# Altium schematic sheet FU-AM-FU6861-B-025-HW-V1.0-20210601.SCHDOC: ?
size A3; SheetNumber: 0; SheetTotal: 0; PageSetup: Record=PageOptions|CenterHorizontal=True|CenterVertical=True|PrintScale=0.81|XCorrection=1.00|YCorrection=1.00|PrintKind=0|BorderSize=5000000|LeftOffset=0|BottomOffset=0|Orientation=2|PaperLength=1000|PaperWidth=1000|Scale=100|PaperSource=7|PrintQuality=-4|MediaType=1|DitherType=10|PaperKind=A4|PrintScaleMode=1
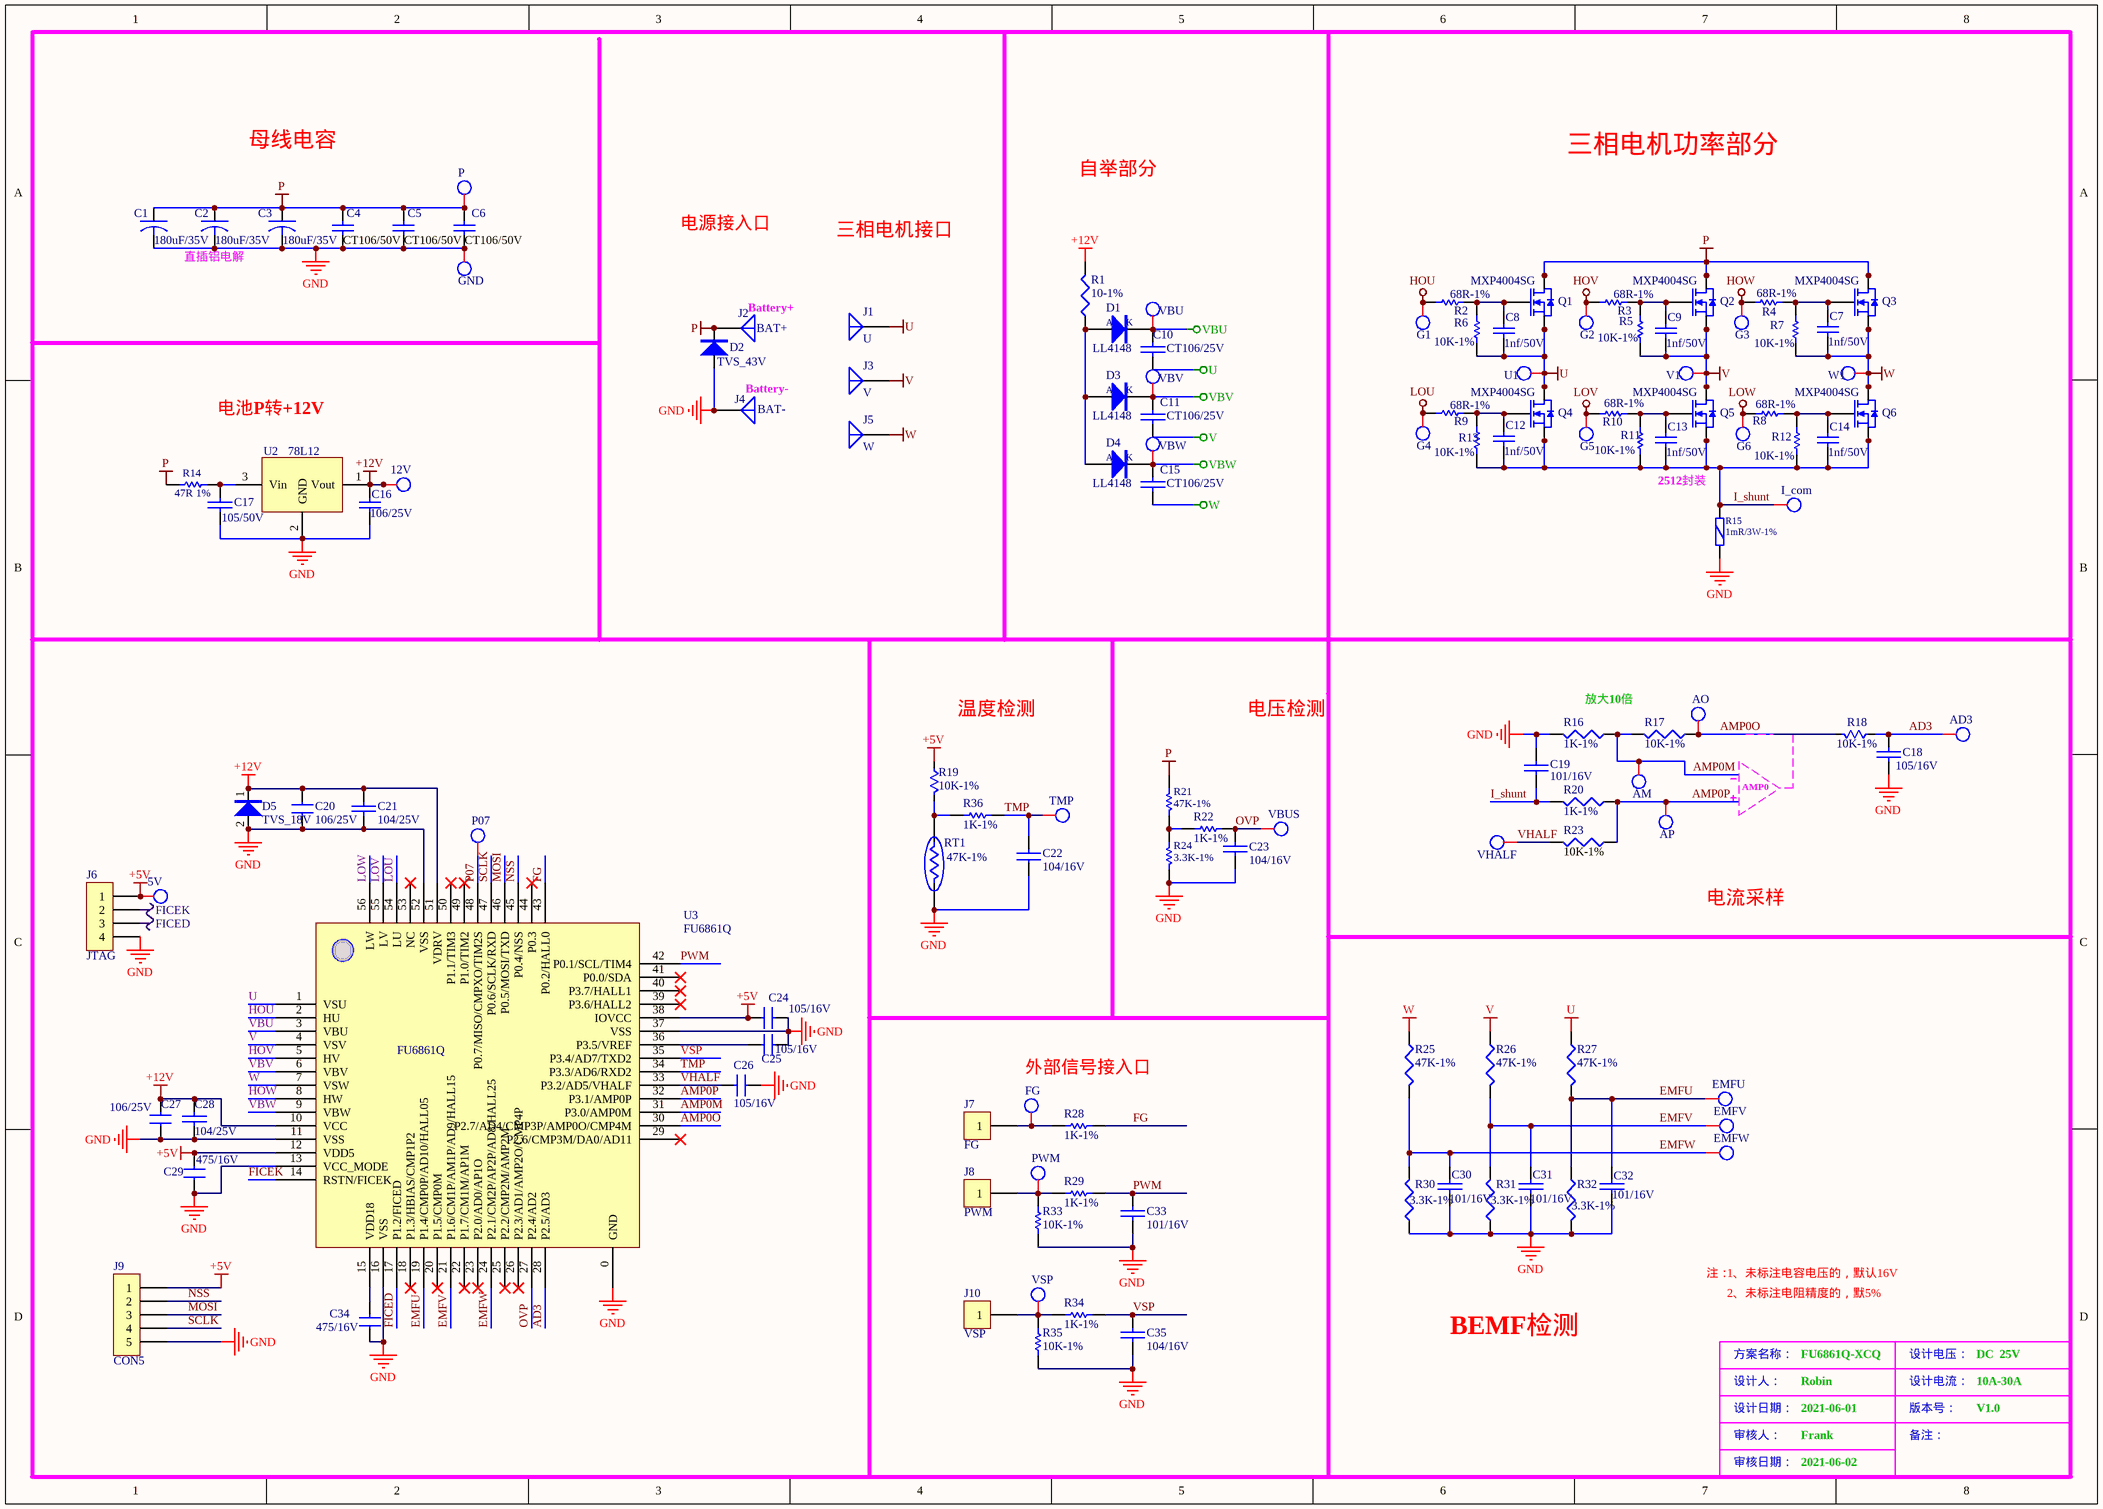
[diagram p0: FU-AM-FU6861-B-025-HW-V1.0-20210601.SCHDOC]

## Parts
5V  (no value)  [TP1.1]
12V  (no value)  [TP1.1]
AD3  (no value)  [TP1.1]
AM  (no value)  [TP1.1]
AO  (no value)  [TP1.1]
AP  (no value)  [TP1.1]
C1  180uF/35V  [CAP2_5]
C2  180uF/35V  [CAP2_5]
C3  180uF/35V  [CAP2_5]
C4  CT106/50V  [c1206]
C5  CT106/50V  [c1206]
C6  CT106/50V  [c1206]
C7  1nf/50V  [c0603]
C8  1nf/50V  [C0603]
C9  1nf/50V  [C0603]
C10  CT106/25V  [c0805]
C11  CT106/25V  [c0805]
C12  1nf/50V  [c0603]
C13  1nf/50V  [C0603]
C14  1nf/50V  [C0603]
C15  CT106/25V  [c0805]
C16  106/25V  [C0805]
C17  105/50V  [c1206]
C18  105/16V  [c0603]
C19  101/16V  [c0603]
C20  106/25V  [c0805]
C21  104/25V  [c0603]
C22  104/16V  [c0603]
C23  104/16V  [c0603]
C24  105/16V  [c0603]
C25  105/16V  [c0603]
C26  105/16V  [c0603]
C27  106/25V  [c0805]
C28  104/25V  [c0603]
C29  475/16V  [c0603]
C30  101/16V  [c0603]
C31  101/16V  [c0603]
C32  101/16V  [c0603]
C33  101/16V  [c0603]
C34  475/16V  [c0603]
C35  104/16V  [c0603]
D1  LL4148  [SOD-123]
D2  TVS_43V  [DO214AA, SMB]
D3  LL4148  [SOD-123]
D4  LL4148  [SOD-123]
D5  TVS_18V  [DO214AC, SMA]
EMFU  (no value)  [TP1.1]
EMFV  (no value)  [TP1.1]
EMFW  (no value)  [TP1.1]
FG  (no value)  [TP1.1]
G1  (no value)  [TP1.1]
G2  (no value)  [TP1.1]
G3  (no value)  [TP1.1]
G4  (no value)  [TP1.1]
G5  (no value)  [TP1.1]
G6  (no value)  [TP1.1]
GND  (no value)  [TP1.1]
I_com  (no value)  [TP1.1]
J1  U  [AD]
J2  BAT+  [DY]
J3  V  [AD]
J4  BAT-  [DY]
J5  W  [AD]
J6  JTAG  [SIP4-2]
J7  FG  [tp]
J8  PWM  [tp]
J9  CON5  [SIP5-2]
J10  VSP  [tp]
P  (no value)  [TP1.1]
P07  (no value)  [TP1.1]
PWM  (no value)  [TP1.1]
Q1  MXP4004SG  [PQFQ5X6]
Q2  MXP4004SG  [PQFQ5X6]
Q3  MXP4004SG  [PQFQ5X6]
Q4  MXP4004SG  [PQFQ5X6]
Q5  MXP4004SG  [PQFQ5X6]
Q6  MXP4004SG  [PQFQ5X6]
R1  10-1%  [r1206]
R2  68R-1%  [r0603]
R3  68R-1%  [r0603]
R4  68R-1%  [r0603]
R5  10K-1%  [r0603]
R6  10K-1%  [r0603]
R7  10K-1%  [r0603]
R8  68R-1%  [r0603]
R9  68R-1%  [r0603]
R10  68R-1%  [r0603]
R11  10K-1%  [r0603]
R12  10K-1%  [r0603]
R13  10K-1%  [r0603]
R14  47R 1%  [R1206]
R15  1mR/3W-1%  [r2512]
R16  1K-1%  [r0603]
R17  10K-1%  [r0603]
R18  10K-1%  [r0603]
R19  10K-1%  [r0603]
R20  1K-1%  [r0603]
R21  47K-1%  [r0603]
R22  1K-1%  [r0603]
R23  10K-1%  [r0603]
R24  3.3K-1%  [r0603]
R25  47K-1%  [r0603]
R26  47K-1%  [r0603]
R27  47K-1%  [r0603]
R28  1K-1%  [r0603]
R29  1K-1%  [r0603]
R30  3.3K-1%  [r0603]
R31  3.3K-1%  [r0603]
R32  3.3K-1%  [r0603]
R33  10K-1%  [r0603]
R34  1K-1%  [r0603]
R35  10K-1%  [r0603]
R36  1K-1%  [r0603]
RT1  47K-1%  [r0805]
TMP  (no value)  [TP1.1]
U1  (no value)  [TP1.1]
U2  78L12  [SOT-89]
U3  FU6861Q  [QFN56]
V1  (no value)  [TP1.1]
VBU  (no value)  [TP1.1]
VBUS  (no value)  [TP1.1]
VBV  (no value)  [TP1.1]
VBW  (no value)  [TP1.1]
VHALF  (no value)  [TP1.1]
VSP  (no value)  [TP1.1]
W1  (no value)  [TP1.1]

## Nets
+5V: 5V.1 C24.1 C29.1 J6.1 J9.1 R19.1 U3.12(VDD5) U3.38(IOVCC)
+12V: 12V.1 C16.2 C20.2 C21.2 C27.2 C28.1 D5.1 R1.2 U2.1(Vout) U3.10(VCC) U3.51(VDRV)
FICED: J6.3 U3.17(P1.2/FICED)
FICEK: J6.2 U3.14(RSTN/FICEK)
GND: C1.2 C2.2 C3.2 C4.1 C5.1 C6.1 C16.1 C17.2 C18.2 C19.1 C20.1 C21.1 C22.1 C23.2 C24.2 C25.1 C26.2 C27.1 C28.2 C29.2 C30.2 C31.2 C32.1 C33.1 C34.2 C35.1 D2.2 D5.2 GND.1 J4.1(GND) J6.4 J9.5 R15.1 R16.2 R24.2 R30.1 R31.1 R32.2 R33.1 R35.1 RT1.2 U2.2(GND) U3.0(GND) U3.11(VSS) U3.13(VCC_MODE) U3.16(VSS) U3.37(VSS) U3.52(VSS)
HOU: G1.1 R2.1 U3.2(HU)
HOV: G2.1 R3.1 U3.5(HV)
HOW: G3.1 R4.1 U3.8(HW)
LOU: G4.1 R9.1 U3.54(LU)
LOV: G5.1 R10.1 U3.55(LV)
LOW: G6.1 R8.1 U3.56(LW)
P: C1.1 C2.1 C3.1 C4.2 C5.2 C6.2 D2.1 J2.1(+42V) P.1 Q1.5(D) Q1.6(D) Q1.7(D) Q1.8(D) Q2.5(D) Q2.6(D) Q2.7(D) Q2.8(D) Q3.5(D) Q3.6(D) Q3.7(D) Q3.8(D) R14.1 R21.1
U: C8.1 C10.1 J1.1(U) Q1.1(S) Q1.2(S) Q1.3(S) Q4.5(D) Q4.6(D) Q4.7(D) Q4.8(D) R6.1 R27.1 U1.1 U3.1(VSU)
V: C9.1 C11.1 J3.1(V) Q2.1(S) Q2.2(S) Q2.3(S) Q5.5(D) Q5.6(D) Q5.7(D) Q5.8(D) R5.1 R26.1 U3.4(VSV) V1.1
VBU: C10.2 D1.2 U3.3(VBU) VBU.1
VBV: C11.2 D3.2 U3.6(VBV) VBV.1
VBW: C15.2 D4.2 U3.9(VBW) VBW.1
W: C7.1 C15.1 J5.1(W) Q3.1(S) Q3.2(S) Q3.3(S) Q6.5(D) Q6.6(D) Q6.7(D) Q6.8(D) R7.1 R25.1 U3.7(VSW) W1.1
AD3: AD3.1 C18.1 R18.1 U3.28(P2.5/AD3)
AMP0M: AM.1 R16.1 R17.2 U3.31(P3.0/AMP0M)
AMP0O: AO.1 R17.1 R18.2 U3.30(P2.7/AD4/CMP3P/AMP0O/CMP4M)
AMP0P: AP.1 R20.1 R23.1 U3.32(P3.1/AMP0P)
EMFU: C32.2 EMFU.1 R27.2 R32.1 U3.19(P1.4/CMP0P/AD10/HALL05)
EMFV: C31.1 EMFV.1 R26.2 R31.2 U3.21(P1.6/CM1P/AM1P/AD9/HALL15)
EMFW: C30.1 EMFW.1 R25.2 R30.2 U3.24(P2.1/CM2P/AP2P/AD8/HALL25)
FG: R28.2 U3.43(P0.2/HALL0)
I_shunt: C12.1 C13.1 C14.1 C19.2 I_com.1 Q4.1(S) Q4.2(S) Q4.3(S) Q5.1(S) Q5.2(S) Q5.3(S) Q6.1(S) Q6.2(S) Q6.3(S) R11.1 R12.1 R13.1 R15.2 R20.2
MOSI: J9.3 U3.46(P0.5/MOSI/TXD)
NSS: J9.2 U3.45(P0.4/NSS)
OVP: C23.1 R22.2 U3.27(P2.4/AD2) VBUS.1
P07: P07.1 U3.48(P0.7/MISO/CMPXO/TIM2S)
PWM: C33.2 R29.2 U3.42(P0.1/SCL/TIM4)
SCLK: J9.4 U3.47(P0.6/SCLK/RXD)
TMP: C22.2 R36.2 TMP.1 U3.34(P3.3/AD6/RXD2)
VHALF: C26.1 R23.2 U3.33(P3.2/AD5/VHALF) VHALF.1
VSP: C35.2 R34.2 U3.35(P3.4/AD7/TXD2)
NetC7_2: C7.2 Q3.4(G) R4.2 R7.2
NetC8_2: C8.2 Q1.4(G) R2.2 R6.2
NetC9_2: C9.2 Q2.4(G) R3.2 R5.2
NetC12_2: C12.2 Q4.4(G) R9.2 R13.2
NetC13_2: C13.2 Q5.4(G) R10.2 R11.2
NetC14_2: C14.2 Q6.4(G) R8.2 R12.2
NetC17_1: C17.1 R14.2 U2.3(Vin)
NetC25_2: C25.2 U3.36(P3.5/VREF)
NetC34_1: C34.1 U3.15(VDD18)
NetD1_1: D1.1 D3.1 D4.1 R1.1
NetFG_1: FG.1 J7.1 R28.1
NetJ8_1: J8.1 PWM.1 R29.1 R33.2
NetJ10_1: J10.1 R34.1 R35.2 VSP.1
NetR19_2: R19.2 R36.1 RT1.1
NetR21_2: R21.2 R22.1 R24.1

Not connected (* = marked no-connect by the designer): U3 18(P1.3/HBIAS/CMP1P2)* 20(P1.5/CMP0M)* 22(P1.7/CM1M/AP1M)* 23(P2.0/AD0/AP1O)* 25(P2.2/CMP2M/AMP2M)* 26(P2.3/AD1/AMP2O/CMP4P)* 29(P2.6/CMP3M/DA0/AD11)* 39(P3.6/HALL2)* 40(P3.7/HALL1)* 41(P0.0/SDA)* 44(P0.3)* 49(P1.0/TIM2)* 50(P1.1/TIM3)* 53(NC)*

## Notes on the sheet
- 母线电容
- 自举部分
- 三相电机功率部分
- 电源接入口
- 三相电机接口
- (near C2) 直插铝电解
- (near J2) Battery+
- 电池P转+12V
- (near J4) Battery-
- 2512封装
- (near R19) 温度检测
- 电压检测
- (near R16) 放大10倍
- AMP0
- 电流采样
- 外部信号接入口
- 注：
- 1、未标注电容电压的，默认16V
- 2、未标注电阻精度的，默5%
- BEMF检测
- 方案名称：
- 设计人：
- FU6861Q-XCQ
- Robin
- 设计电压：
- 设计电流：
- DC  25V
- 10A-30A
- 设计日期：
- 审核人：
- 2021-06-01
- Frank
- 版本号：
- 备注：
- V1.0
- 审核日期：
- 2021-06-02
- (in symbol DIODE) A; K

## Library data of the parts
5V 12V AD3 AM AO AP EMFU EMFV EMFW FG G1-G6 GND I_com P P07 PWM TMP U1 V1 VBU VBUS VBV VBW VHALF VSP W1 = Component_1
C1-C3 = CAPACITOR
C4-C9 C12-C14 = Cap: YG-C1206K106-50V（10UF）-10%; Value: 1nF; Published: 8-Jun-2000; LatestRevisionDate: 17-Jul-2002; LatestRevisionNote: Re-released for DXP Platform.; Publisher: Altium Limited
C10 C11 C15 = CAP-CC(SMD): Capacitor
C16 = Cap Semi: Capacitor (Semiconductor SIM Model); Value: 22uF/25V; Published: 8-Jun-2000; LatestRevisionDate: 29-May-2009; LatestRevisionNote: IPC-7351 Footprint Added.; PackageReference: C1206; Publisher: Altium Limited; PackageDescription: Chip Capacitor
C17 C19 C20 C23-C27 C29-C35 = CAP: Capacitor
C18 = CAP
C21 C28 = CAP-CC: Capacitor
C22 = CAP NP: Text Field1: 20; Text Field2: 10
D1 D3 D4 = DIODE
D2 D5 = D1206
J1-J5 = ANTENNA: Generic Antenna
J6 = CON4: Connector
J7 J8 J10 = CON1: Connector
J9 = CON5: Connector
Q1-Q6 = MOSFET-N
R1 R16 R17 R20 R23 R25-R27 R30-R32 = RES(SMD)
R2-R4 R8-R10 R22 R28 R29 R33-R36 = Res Semi: Semiconductor Resistor; Value: 100; Published: 8-Jun-2000; LatestRevisionDate: 17-Jul-2002; LatestRevisionNote: Re-released for DXP Platform.; PackageReference: AXIAL-0.5; Publisher: Altium Limited
R5-R7 R11-R13 = Res Semi: YG-R0603F2002(20KΩ)-1%; Value: 20K; Published: 8-Jun-2000; LatestRevisionDate: 17-Jul-2002; LatestRevisionNote: Re-released for DXP Platform.; PackageReference: AXIAL-0.5; Publisher: Altium Limited
R14 = res1: R0603F1001(1KΩ)-1%; Value: 1K; Published: 8-Jun-2000; Revision: July-2002: Re-released for DXP Platform.; Publisher: Altium Limited
R15 = R-RES/2
R18 R19 = RES3
R21 R24 = res1: Resistor; Value: 1K; Published: 8-Jun-2000; Revision: July-2002: Re-released for DXP Platform.; Publisher: Altium Limited
RT1 = Res Thermal: Thermistor; Published: 24-Mar-1999; LatestRevisionDate: 29-May-2009; LatestRevisionNote: IPC-7351 Footprint Added.; PackageVersion: Mar-2003; PackageReference: 6-0805; Publisher: Altium Limited; PackageDescription: Chip Resistor 0805 Case Size; Code_IPC: RESC2012
U2 = VOLTREG: 78M12